# EAGLE schematic OF1 v1 (EAGLE 9.6.0)
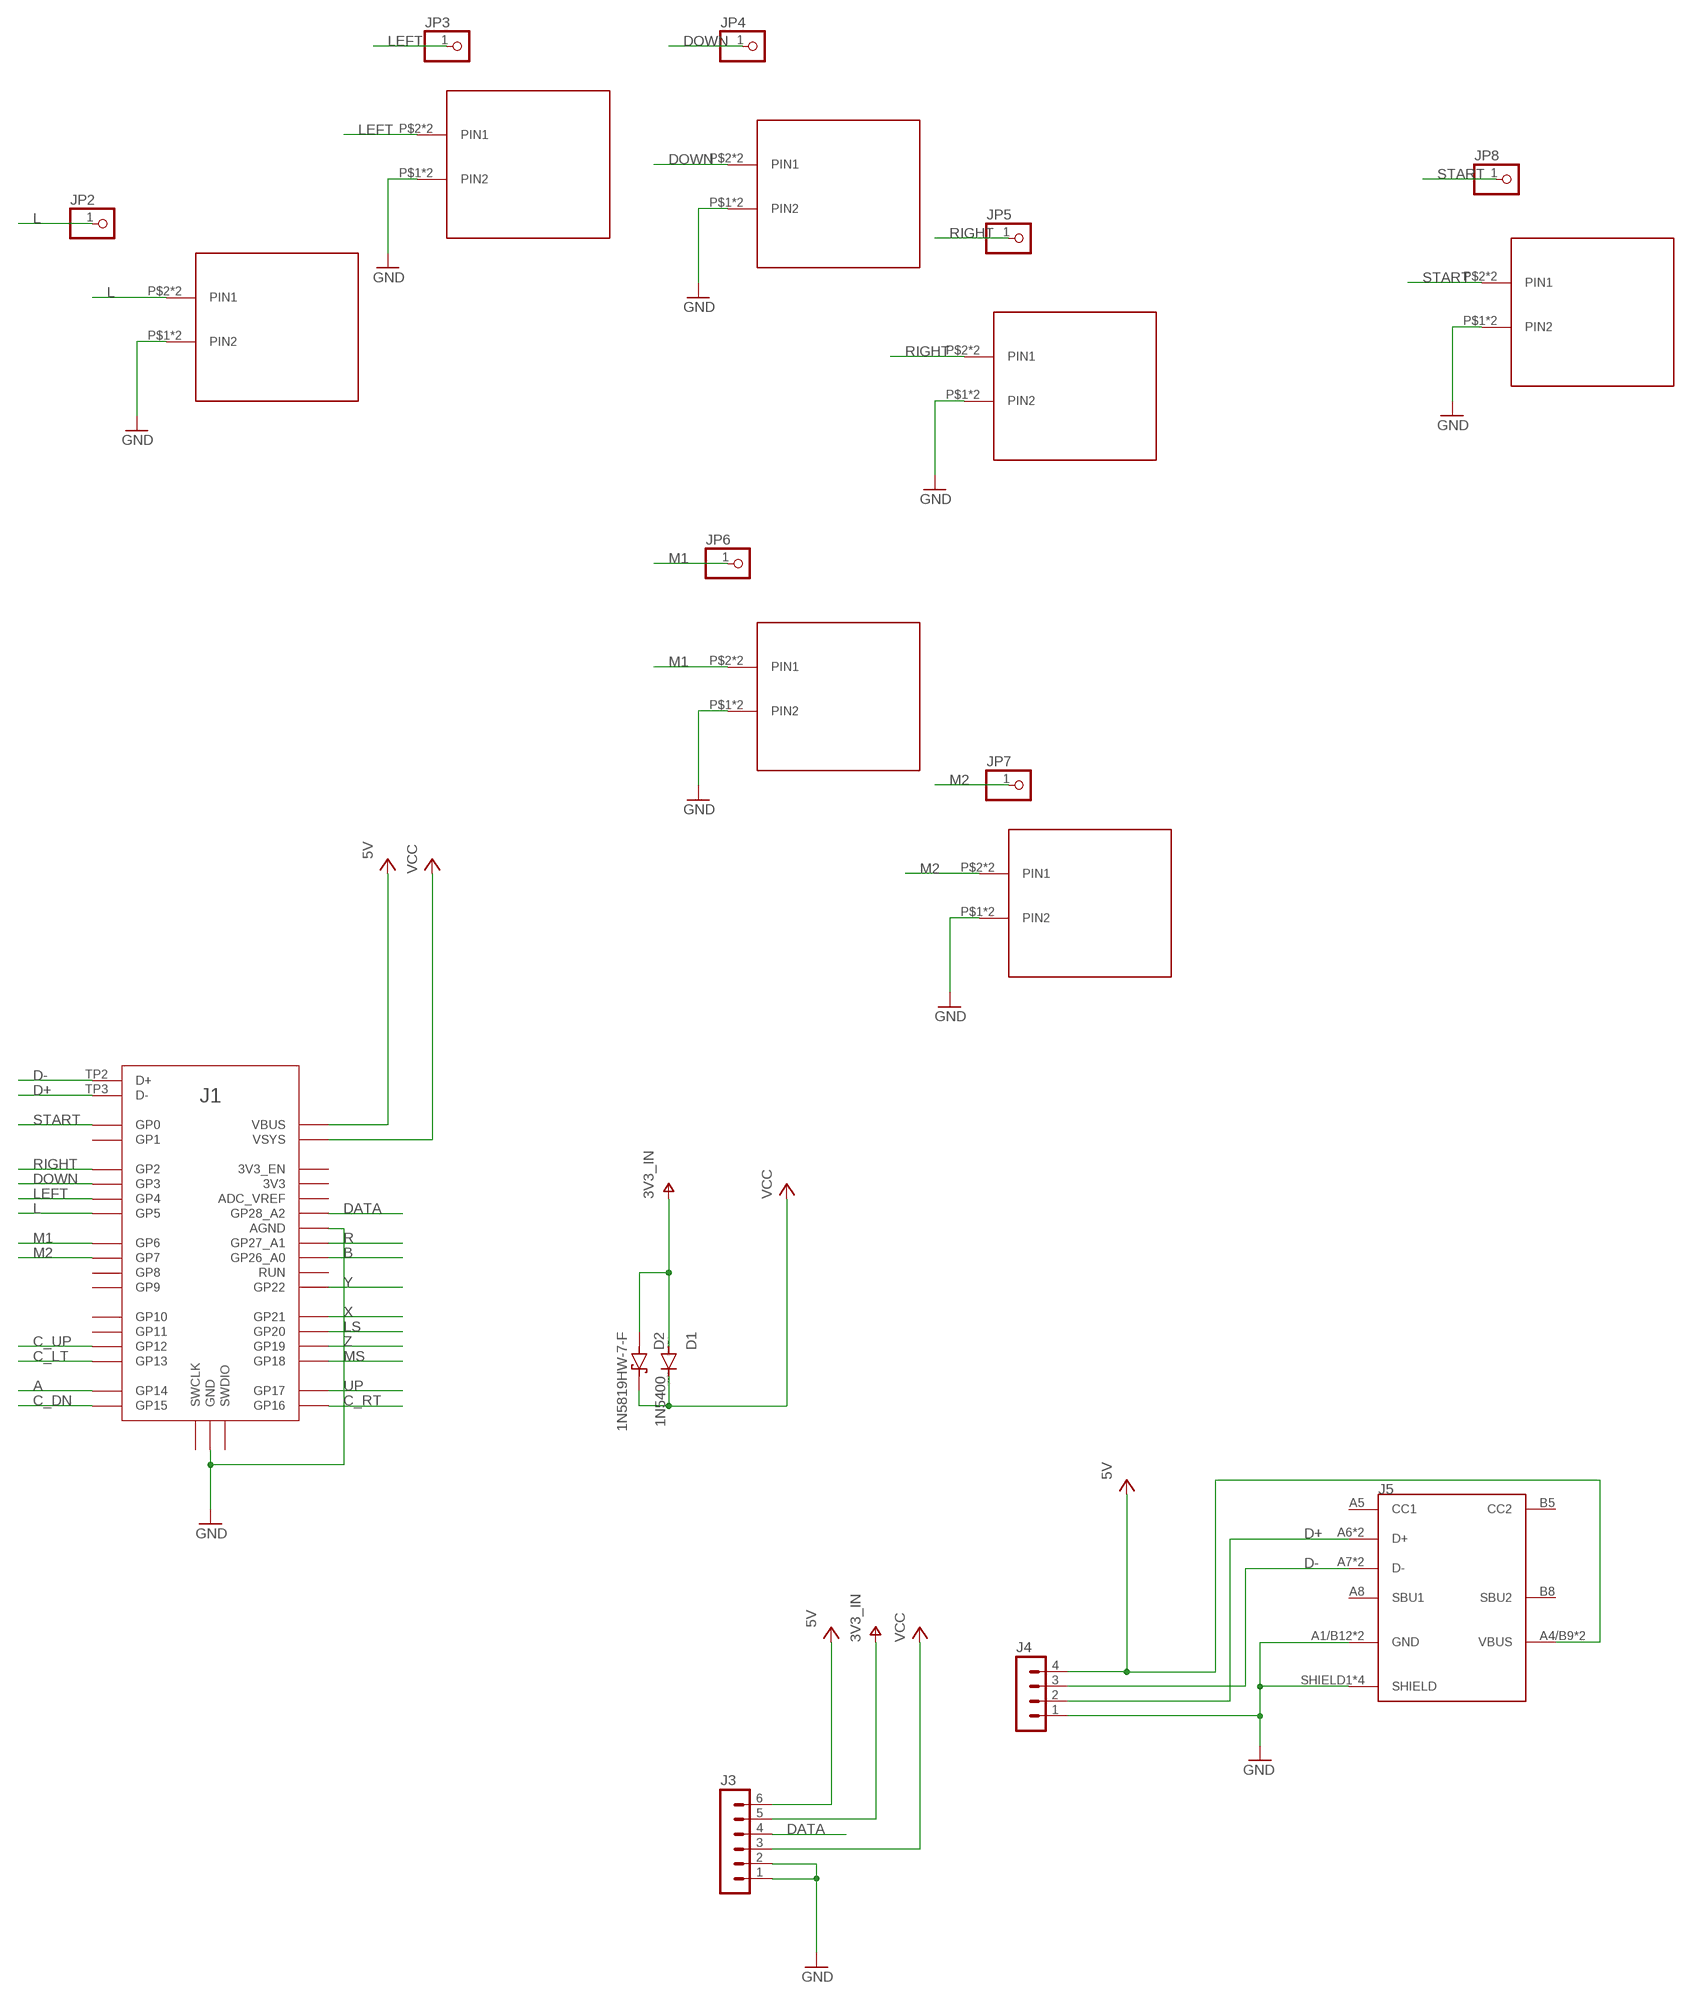
[diagram p0: schematic, sheet 1, part 1 of 2]
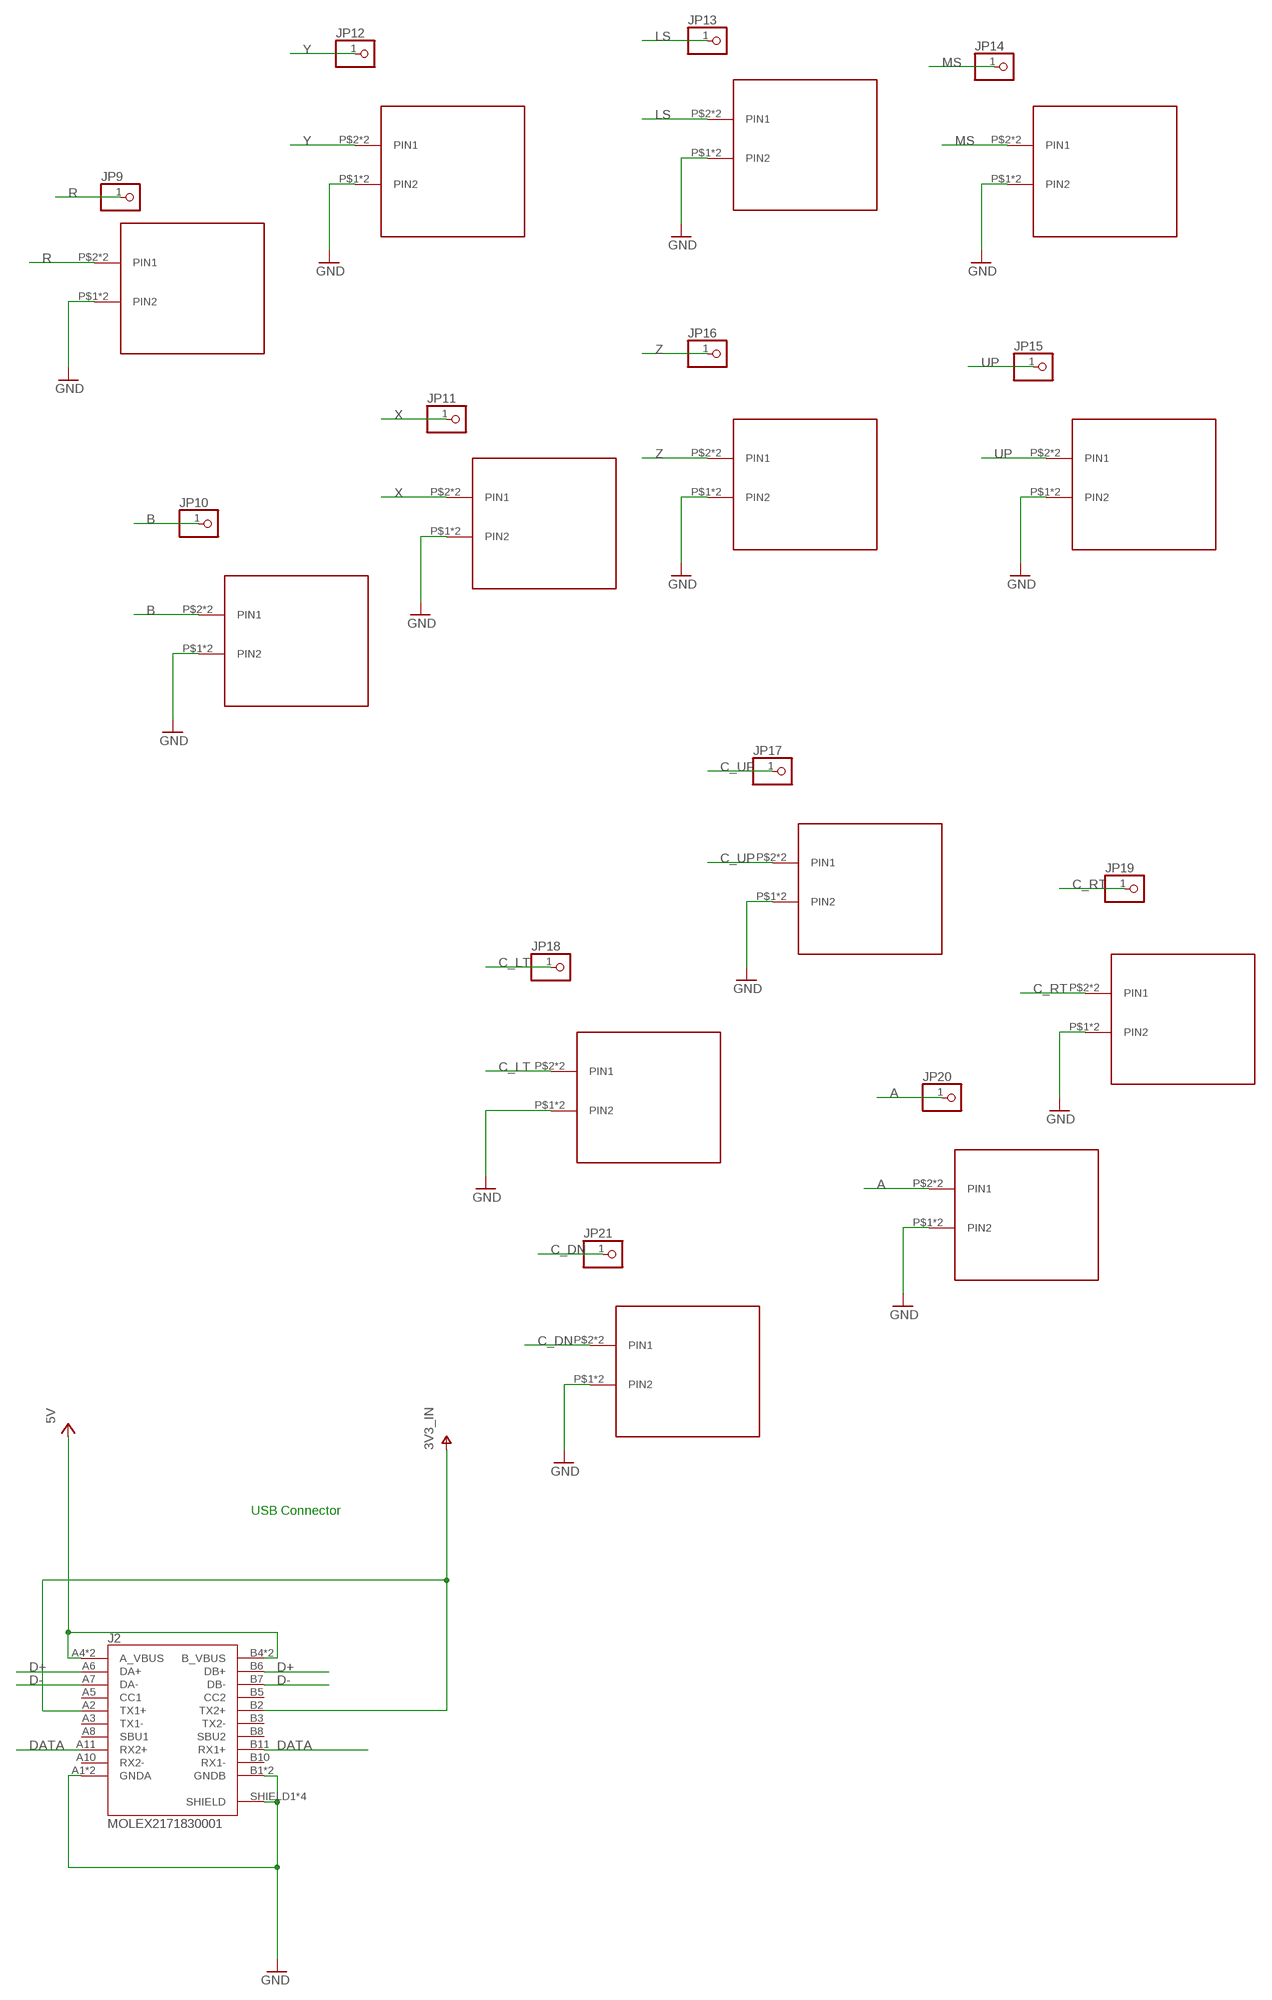
[diagram p1: schematic, sheet 1, part 2 of 2]

## Parts
D1  1N5400  [DO201-15]
D2  1N5819HW-7-F  [SOD3715X145N]
J1  RPI_PICO-TH  [RPI_PICO_TH]
J2  MOLEX2171830001  [24P]
J3  MA06-1  [MA06-1]
J4  MA04-1  [MA04-1]
J5  GT-USB-7010ASV  [16P]
JP2  PINHD-1X1  [1X01]
JP3  PINHD-1X1  [1X01]
JP4  PINHD-1X1  [1X01]
JP5  PINHD-1X1  [1X01]
JP6  PINHD-1X1  [1X01]
JP7  PINHD-1X1  [1X01]
JP8  PINHD-1X1  [1X01]
JP9  PINHD-1X1  [1X01]
JP10  PINHD-1X1  [1X01]
JP11  PINHD-1X1  [1X01]
JP12  PINHD-1X1  [1X01]
JP13  PINHD-1X1  [1X01]
JP14  PINHD-1X1  [1X01]
JP15  PINHD-1X1  [1X01]
JP16  PINHD-1X1  [1X01]
JP17  PINHD-1X1  [1X01]
JP18  PINHD-1X1  [1X01]
JP19  PINHD-1X1  [1X01]
JP20  PINHD-1X1  [1X01]
JP21  PINHD-1X1  [1X01]
U$1  MX-B  [MX-BOTH]
U$2  MX-B  [MX-BOTH]
U$4  MX-B  [MX-BOTH]
U$5  MX-B  [MX-BOTH]
U$6  MX-B  [MX-BOTH]
U$7  MX-B  [MX-BOTH]
U$8  MX-B  [MX-BOTH]
U$9  MX-B  [MX-BOTH]
U$10  MX-B  [MX-BOTH]
U$11  MX-B  [MX-BOTH]
U$12  MX-B  [MX-BOTH]
U$13  MX-B  [MX-BOTH]
U$14  MX-B  [MX-BOTH]
U$15  MX-B  [MX-BOTH]
U$16  MX-B  [MX-BOTH]
U$17  MX-B  [MX-BOTH]
U$18  MX-B  [MX-BOTH]
U$19  MX-B  [MX-BOTH]
U$20  MX-B  [MX-BOTH]
U$21  MX-B  [MX-BOTH]

## Nets
+5V: J1.VBUS J2.A4(A_VBUS) J2.A9(A_VBUS) J2.B4(B_VBUS) J2.B9(B_VBUS) J3.6 J4.4 J5.A4/B9(VBUS) J5.B4/A9(VBUS) ; supply symbol labelled 5V
A: J1.GP14 JP20.1 U$20.P$2(PIN1) U$20.P$3(PIN1)
B: J1.GP26_A0 JP10.1 U$13.P$2(PIN1) U$13.P$3(PIN1)
C_DN: J1.GP15 JP21.1 U$21.P$2(PIN1) U$21.P$3(PIN1)
C_LT: J1.GP13 JP18.1 U$18.P$2(PIN1) U$18.P$3(PIN1)
C_RT: J1.GP16 JP19.1 U$19.P$2(PIN1) U$19.P$3(PIN1)
C_UP: J1.GP12 JP17.1 U$17.P$2(PIN1) U$17.P$3(PIN1)
D+: J1.TP3(D-) J2.A6(DA+) J2.B6(DB+) J4.2 J5.A6(D+) J5.B6(D+)
D-: J1.TP2(D+) J2.A7(DA-) J2.B7(DB-) J4.3 J5.A7(D-) J5.B7(D-)
DATA: J1.GP28_A2 J2.A11(RX2+) J2.B11(RX1+) J3.4
DOWN: J1.GP3 JP4.1 U$4.P$2(PIN1) U$4.P$3(PIN1)
GND: J1.AGND J1.GND@1(GND) J1.GND@2(GND) J1.GND@3(GND) J1.GND@4(GND) J1.GND@5(GND) J1.GND@6(GND) J1.GND@7(GND) J1.GND@8(GND) J2.A1(GNDA) J2.A12(GNDA) J2.B1(GNDB) J2.B12(GNDB) J2.SHIELD1(SHIELD) J2.SHIELD2(SHIELD) J2.SHIELD3(SHIELD) J2.SHIELD4(SHIELD) J3.1 J3.2 J4.1 J5.A1/B12(GND) J5.B1/A12(GND) J5.SHIELD1(SHIELD) J5.SHIELD2(SHIELD) J5.SHIELD3(SHIELD) J5.SHIELD4(SHIELD) U$1.P$1(PIN2) U$1.P$4(PIN2) U$2.P$1(PIN2) U$2.P$4(PIN2) U$4.P$1(PIN2) U$4.P$4(PIN2) U$5.P$1(PIN2) U$5.P$4(PIN2) U$6.P$1(PIN2) U$6.P$4(PIN2) U$7.P$1(PIN2) U$7.P$4(PIN2) U$8.P$1(PIN2) U$8.P$4(PIN2) U$9.P$1(PIN2) U$9.P$4(PIN2) U$10.P$1(PIN2) U$10.P$4(PIN2) U$11.P$1(PIN2) U$11.P$4(PIN2) U$12.P$1(PIN2) U$12.P$4(PIN2) U$13.P$1(PIN2) U$13.P$4(PIN2) U$14.P$1(PIN2) U$14.P$4(PIN2) U$15.P$1(PIN2) U$15.P$4(PIN2) U$16.P$1(PIN2) U$16.P$4(PIN2) U$17.P$1(PIN2) U$17.P$4(PIN2) U$18.P$1(PIN2) U$18.P$4(PIN2) U$19.P$1(PIN2) U$19.P$4(PIN2) U$20.P$1(PIN2) U$20.P$4(PIN2) U$21.P$1(PIN2) U$21.P$4(PIN2)
L: J1.GP5 JP2.1 U$1.P$2(PIN1) U$1.P$3(PIN1)
LEFT: J1.GP4 JP3.1 U$2.P$2(PIN1) U$2.P$3(PIN1)
LS: J1.GP20 JP13.1 U$11.P$2(PIN1) U$11.P$3(PIN1)
M1: J1.GP6 JP6.1 U$6.P$2(PIN1) U$6.P$3(PIN1)
M2: J1.GP7 JP7.1 U$7.P$2(PIN1) U$7.P$3(PIN1)
MS: J1.GP18 JP14.1 U$12.P$2(PIN1) U$12.P$3(PIN1)
R: J1.GP27_A1 JP9.1 U$9.P$2(PIN1) U$9.P$3(PIN1)
RIGHT: J1.GP2 JP5.1 U$5.P$2(PIN1) U$5.P$3(PIN1)
START: J1.GP0 JP8.1 U$8.P$2(PIN1) U$8.P$3(PIN1)
UP: J1.GP17 JP15.1 U$16.P$2(PIN1) U$16.P$3(PIN1)
V+: D1.A D2.A J2.A2(TX1+) J2.B2(TX2+) J3.5 ; supply symbol labelled 3V3_IN
VCC: D1.C D2.C(K) J1.VSYS J3.3
X: J1.GP21 JP11.1 U$14.P$2(PIN1) U$14.P$3(PIN1)
Y: J1.GP22 JP12.1 U$10.P$2(PIN1) U$10.P$3(PIN1)
Z: J1.GP19 JP16.1 U$15.P$2(PIN1) U$15.P$3(PIN1)
Unconnected: J1.3V3 J1.3V3_EN J1.ADC_VREF J1.GP1 J1.GP8 J1.GP9 J1.GP10 J1.GP11 J1.RUN J1.SWCLK J1.SWDIO J2.A3(TX1-) J2.A5(CC1) J2.A8(SBU1) J2.A10(RX2-) J2.B3(TX2-) J2.B5(CC2) J2.B8(SBU2) J2.B10(RX1-) J5.A5(CC1) J5.A8(SBU1) J5.B5(CC2) J5.B8(SBU2)

## Notes on the sheet
- J5
- USB Connector

## Library data of the parts
D1 = diode:1N5400: DIODE standard rectifier, 3 A, 50 V (Motorola)
D2 = 1N5819HW-7-F:1N5819HW-7-F: 1N5819HW Series 40 V 1 A Surface Mount Schottky Barrier Rectifier - SOD-123 Check availability <https://pricing.snapeda.com/parts/1N5819HW-7-F/Diodes%20Inc./view-part?ref=eda>; AVAILABILITY: In Stock; DESCRIPTION: Diode Schottky 40 V 1A Surface Mount SOD-123; MF: Diodes Inc.; MP: 1N5819HW-7-F; PACKAGE: SOD-123 Fairchild Semiconductor; PRICE: None; PURCHASE-URL: https://pricing.snapeda.com/search/part/1N5819HW-7-F/?ref=eda
J1 = RaspberryPi_Pico:RPI_PICO
J2 = Molex 2171830001 type c:MOLEX2171830001
J3 = con-lstb:MA06-1: PIN HEADER; OC_FARNELL: unknown; OC_NEWARK: unknown
J4 = con-lstb:MA04-1: PIN HEADER; OC_FARNELL: unknown; OC_NEWARK: unknown
J5 = GT-USB-7010ASV:GT-USB-7010ASV
JP2-JP21 = pinhead:PINHD-1X1: PIN HEADER
U$1 U$2 U$4-U$21 = MX-H:MX-B